# Altium schematic sheet PWM_Philter.SchDoc
size A4
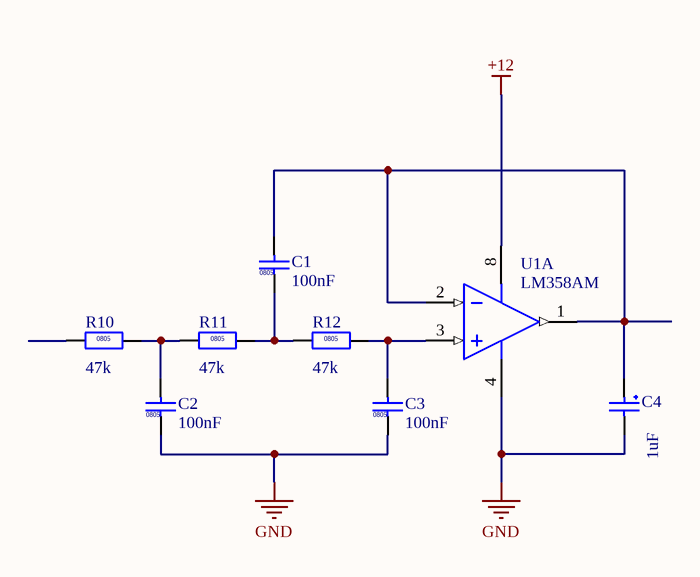
[diagram p0: PWM_Philter.SchDoc]

## Parts
C1  value 100nF  [CAPC2012-0805M]  (hidden comment: CAPC_0805)
C2  value 100nF  [CAPC2012-0805M]  (hidden comment: CAPC_0805)
C3  value 100nF  [CAPC2012-0805M]  (hidden comment: CAPC_0805)
C4  value 1uF  [ECAP511]  (hidden comment: ECAP-511)
R10  value 47k  [RESC2012-0805M]  (hidden comment: RESC_0805_R)
R11  value 47k  [RESC2012-0805M]  (hidden comment: RESC_0805_R)
R12  value 47k  [RESC2012-0805M]  (hidden comment: RESC_0805_R)
U1  LM358AM  [SO-8_L]  (part A of 2)

## Nets
+12: U1.8(V+)
GND: C2.1 C3.1 C4.2 U1.4(GND)
NetC1_1: C1.1 R11.2 R12.1
NetC1_2: C1.2 C4.1 U1.1(OUTA) U1.2(INA-)
NetC2_2: C2.2 R10.2 R11.1
NetC3_2: C3.2 R12.2 U1.3(INA+)

Not connected (* = marked no-connect by the designer): R10 1

## Notes on the sheet
- (in symbol CAPC_0805) 0805
- (in symbol RESC_0805_R) 0805

## Library data of the parts
C1-C3 = CAPC_0805: Capacitor 0805
C4 = ECAP-511: Capacitor electrolytic 2.5 mm pitch, 5*11 body
R10-R12 = RESC_0805_R: Resistor 0805
U1 = LM358AM: Low Power Dual Operational Amplifier; Manufacturer: National Semiconductor; CompType: Amplifiers; PackageTopMarking: NSZXTT*LM*358AM; PowerWise: N; Published: 4-Dec-2008; LatestRevisionDate: 13-Jan-2009; LatestRevisionNote: Sim Model Added.; DatasheetVersion: Oct-2005; PackageVersion: revL, Sep-2006; PackageReference: M08A; Publisher: Altium Limited; PackageDescription: SOIC Narrow, 4.9 x 3.9 x 1.45mm, 8 Lead, 1.27mm Pitch; PartNumber: LM358AM; RoHS: O; PinCount: 8; DigiKeyPartNumber: LM358AMXCT-ND; Code_JEDEC: MS-012-AA; Code_IPC: SOIC127P600-8; ComponentLink1Description: LM358 Datasheet; ComponentLink1URL: http://www.national.com/ds/LM/LM358.pdf; ComponentLink2Description: LM358 Web Page; ComponentLink2URL: http://www.national.com/pf/LM/LM358.html; ComponentLink3Description: M08A Package Page; ComponentLink3URL: http://www.national.com/packaging/folders/m08a.html